# Altium project MC_V1.PrjPcb
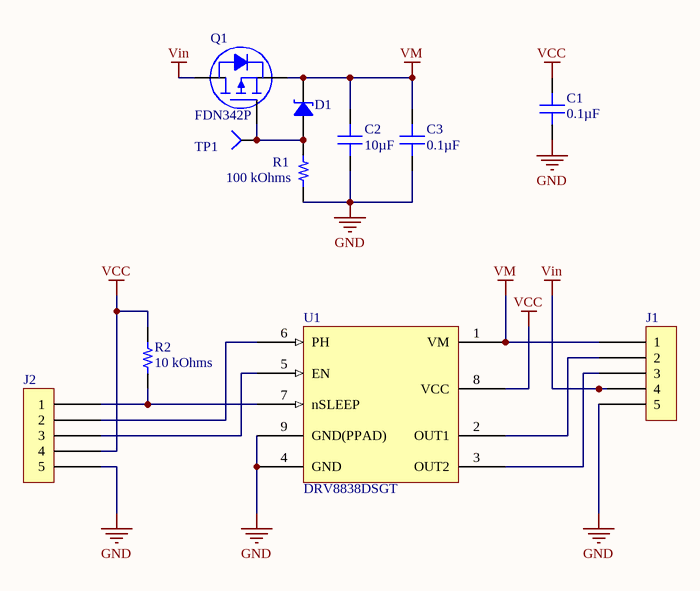
[diagram p0: schematic.SchDoc]
1 sheet, 11 parts. Net scope: global (net labels, ports and power ports of the same name join across sheets).

## Sheet schematic.SchDoc: Motor Controller
size A; DrawnBy: Kyle Hong

### Parts
C1  0.1µF  [CAP 0603_1608]
C2  10µF  [CAP 0805_2012]
C3  0.1µF  [CAP 0603_1608]
D1  1SMA5921BT3G  [DO214AC SMA]  (value not drawn)
J1  JMP_5  (value not drawn)
J2  JMP_5  (value not drawn)
Q1  FDN342P  [DIODES SOT-23-3]
R1  100 kOhms  [RES 0603_1608]
R2  10 kOhms  [RES 0603_1608]
TP1  TESTPOINT_SMD  [TESTPOINT]  (value not drawn)
U1  DRV8838DSGT

### Nets
GND: C1.1 C2.1 C3.1 J1.5 J2.5 R1.1 U1.4(GND) U1.9(GND(PPAD))
VCC: C1.2 J2.4 R2.2 U1.8(VCC)
Vin: J1.4 Q1.3(D)
VM: C2.2 C3.2 D1.2 J1.1 Q1.2(S) U1.1(VM)
NetD1_1: D1.1 Q1.1(G) R1.2 TP1.1(=value)
NetJ1_2: J1.2 U1.2(OUT1)
NetJ1_3: J1.3 U1.3(OUT2)
NetJ2_1: J2.1 R2.1 U1.7(nSLEEP)
NetJ2_2: J2.2 U1.6(PH)
NetJ2_3: J2.3 U1.5(EN)

### Notes on the sheet
- Title
- Size:
- Date:
- A
- Number:
- Time:
- Revision:
- Sheet
- of
- File:

### Library data of the parts
C1 C3 = CC0603JRX7R7BB104: CAP CER 0.1UF 16V X7R 0603; Manufacturer: Yageo; Tolerance: ±5%; Part Number: CC0603JRX7R7BB104; Value: 0.1µF; Applications: General Purpose; Capacitance: 0.1µF; ComponentLink1Description: Datasheet; ComponentLink1URL: https://www.yageo.com/upload/media/product/productsearch/datasheet/mlcc/UPY-GPHC_X7R_6.3V-to-50V_18.pdf; ComponentLink2Description: DigiKey Link; ComponentLink2URL: http://digikey.com/product-detail/en/yageo/CC0603JRX7R7BB104/311-1776-1-ND/5195678; Device Package: 0603 (1608 Metric); LastUpdated: 1/21/2020 12:02:05 AM; Lifecycle Status: Active; Minimum Order: 1; Mounting Type: Surface Mount, MLCC; Operating Temperature: -55°C ~ 125°C; Package / Case: 0603 (1608 Metric); Packaging: TapeAndReel; PartId: 5272; Part Status: Active; Price: 0.01; Series: CC; Size / Dimension: 0.063" L x 0.031" W (1.60mm x 0.80mm); Supplier 1: DigiKey; Supplier Part Number 1: 311-1776-1-ND; Temperature Coefficient: X7R; Thickness (Max): 0.035" (0.90mm); Voltage - Rated: 16V
C2 = CC0805KKX5R7BB106: CAP CER 10UF 16V X5R 0805; Manufacturer: Yageo; Tolerance: ±10%; Part Number: CC0805KKX5R7BB106; Value: 10µF; Applications: General Purpose; Capacitance: 10µF; ComponentLink1Description: Datasheet; ComponentLink1URL: https://www.yageo.com/upload/media/product/productsearch/datasheet/mlcc/UPY-GPHC_X5R_4V-to-50V_25.pdf; ComponentLink2Description: DigiKey Link; ComponentLink2URL: http://digikey.com/product-detail/en/yageo/CC0805KKX5R7BB106/311-1865-1-ND/5195767; Device Package: 0805 (2012 Metric); LastUpdated: 1/21/2020 12:02:56 AM; Lifecycle Status: Active; Minimum Order: 1; Mounting Type: Surface Mount, MLCC; Operating Temperature: -55°C ~ 85°C; Package / Case: 0805 (2012 Metric); Packaging: TapeAndReel; PartId: 8867; Part Status: Active; Price: 0.09; Series: CC; Size / Dimension: 0.079" L x 0.049" W (2.00mm x 1.25mm); Supplier 1: DigiKey; Supplier Part Number 1: 311-1865-1-ND; Temperature Coefficient: X5R; Thickness (Max): 0.057" (1.45mm); Voltage - Rated: 16V
D1 = 1SMA5921BT3G: DIODE ZENER 6.8V 1.5W SMA; Manufacturer: ON Semiconductor; Current - Reverse Leakage @ Vr: 2.5µA @ 5.2V; Impedance (Max) (Zzt): 2.5 Ohms; Tolerance: ±5%; Voltage - Forward (Vf) (Max) @ If: 1.5V @ 200mA; Part Number: 1SMA5921BT3G; ComponentLink1Description: Datasheet; ComponentLink1URL: https://www.onsemi.com/pub/Collateral/1SMA5913BT3-D.PDF; ComponentLink2Description: DigiKey Link; ComponentLink2URL: http://digikey.com/product-detail/en/on-semiconductor/1SMA5921BT3G/1SMA5921BT3GOSCT-ND/1474708; Device Package: DO-214AC, SMA; LastUpdated: 1/21/2020 2:46:09 AM; Lifecycle Status: Active; Minimum Order: 1; Mounting Type: Surface Mount; Operating Temperature: -65°C ~ 150°C; Package / Case: DO-214AC, SMA; Packaging: TapeAndReel; PartId: 1578; Part Status: Active; Power - Max: 1.5W; Price: 0.09; Series: -; Supplier 1: DigiKey; Supplier Part Number 1: 1SMA5921BT3GOSCT-ND; Supplier Device Package: SMA; Voltage - Zener (Nom) (Vz): 6.8V
J1 J2 = JMP_5: HEADER 5x1; Manufacturer 1: TE Connectivity; Manufacturer Part Number 1: 3-644456-5; Underplate Material: Nickel; Number of Positions: 5; Connector Type: Plug,Header,Pin; Gender: Male; Current Rating: 5A; Connector System: Wire-to-Board; PCB Mount Retention: Without; Voltage Rating: 250V; PCB Mounting Orientation: Vertical; Mating Alignment: No (Without); Plating Thickness: 1.27um; Contact Resistance: 6mR; Pitch: 2.54mm; PCB Thickness: 0.063inch; Tail Length: 0.11inch; Approvals: CSA; Supplier 1: Digi-Key; Stock 1: 10086; Pricing 1: 1=0.44000, 10=0.41500, 100=0.29070, 500=0.24918, 1000=0.20766, 5000=0.17799, 10000=0.16612 (USD); RoHS: Yes; Mount: Through Hole; Contact Plating: Tin,Matte; Contact Material: Copper Alloy; Housing Color: Natural; Housing Material: Polyester; Color: Natural; Contact Shape: Square; Min Operating Temperature: -67°C; Max Operating Temperature: 221°C; Termination: Solder; Orientation: Straight; Packaging: Bag; Package Quantity: 500; Number of Contacts: 5; Number of Rows: 1; Contact Current Rating: 5A; Max Voltage Rating (AC): 250V; Sealable: No (Without); Mating Retention: No (Without); PCB Mount Alignment: No (Without); Contact Gender: Male; Voltage Rating (AC): 250V; Contact Retention: No (Without); Strain Relief: No (Without); Shrouded: No (Without); Backwall/Post Interruptions: No (Without); Length: 12.4mm; Height: 10.03mm; Depth: 2.33mm; Contact Mating Length: 0.295inch; Radiation Hardening: No; REACH SVHC: Unknown; ELV: Compliant; Lead Free: Lead Free; Flammability Rating: UL94 V-0; ComponentLink1URL: https://datasheet.ciiva.com/16307/3-644456-5-16307486.pdf?src-supplier=Future+Electronics; ComponentLink1Description: https://datasheet.ciiva.com/16307/3-644456-5-16307486.pdf?src-supplier=Future+Electronics; ComponentLink2URL: https://datasheet.ciiva.com/3118/eng-ds-82056-mta-0608-3118213.pdf?src-supplier=Avnet; ComponentLink2Description: https://datasheet.ciiva.com/3118/eng-ds-82056-mta-0608-3118213.pdf?src-supplier=Avnet; ComponentLink3URL: https://datasheet.ciiva.com/14641/70087179-14641766.pdf?src-supplier=Allied+Electronics; ComponentLink3Description: https://datasheet.ciiva.com/14641/70087179-14641766.pdf?src-supplier=Allied+Electronics; ComponentLink4URL: https://datasheet.ciiva.com/30250/8852eng-ds-82056-mta-0608-30250984.pdf?src-supplier=Onlinecomponents.com; ComponentLink4Description: https://datasheet.ciiva.com/30250/8852eng-ds-82056-mta-0608-30250984.pdf?src-supplier=Onlinecomponents.com; ComponentLink5URL: https://datasheet.ciiva.com/709/eng-cd-644456-d2-709724.pdf?src-supplier=Digi-Key; ComponentLink5Description: https://datasheet.ciiva.com/709/eng-cd-644456-d2-709724.pdf?src-supplier=Digi-Key; Supplier Part Number 1: A31115-ND
Q1 = ZXMP10A13FQTA: MOSFET P-CH 20V 2A SSOT-3; Manufacturer 1: ON Semiconductor / Fairchild; Rds On Max: 80mR; Input Capacitance: 635pF; Rise Time: 8ns; Nominal Vgs: 1.05V; Number of Elements: 1; Max Power Dissipation: 500mW; Drain to Source Resistance: 62mR; Turn-Off Delay Time: 9ns; Turn-On Delay Time: 20ns; Element Configuration: Single; Drain to Source Breakdown Voltage: -20V; Gate to Source Voltage (Vgs): 12V; Current Rating: -2A; ComponentLink1Description: Datasheet; ComponentLink1URL: https://www.diodes.com/assets/Datasheets/ZXMP10A13FQ.pdf; ComponentLink2Description: DigiKey Link; ComponentLink2URL: http://digikey.com/product-detail/en/diodes-incorporated/ZXMP10A13FQTA/ZXMP10A13FQTADICT-ND/5225337; Supplier 1: Digi-Key; Manufacturer Part Number 1: FDN342P; Stock 1: 21061; Pricing 1: 1=0.49000, 10=0.42200, 25=0.39400, 100=0.29270, 250=0.27808, 500=0.22854, 1000=0.18576 (USD); RoHS: Yes; Mount: Surface Mount; Case/Package: TO-236-3; Number of Pins: 3; Weight: 0.03g; Min Operating Temperature: -55°C; Max Operating Temperature: 150°C; Packaging: Tape and Reel; Package Quantity: 1; Dual Supply Voltage: 20V; Drain to Source Voltage (Vdss): 20V; Continuous Drain Current (ID): 2A; Fall Time: 8ns; Power Dissipation: 500mW; Threshold Voltage: 1.05V; Termination: SMD/SMT; Voltage Rating (DC): -20V; On-State Resistance: 80mR; Length: 2.92mm; Height: 0.94mm; Width: 1.4mm; Radiation Hardening: No; REACH SVHC: No SVHC; Lead Free: Lead Free; ComponentLink3URL: https://datasheet.ciiva.com/16952/fdn342p-16952032.pdf?src-supplier=Future+Electronics; ComponentLink3Description: https://datasheet.ciiva.com/16952/fdn342p-16952032.pdf?src-supplier=Future+Electronics; ComponentLink4URL: https://datasheet.ciiva.com/6037/162680-6037738.pdf?src-supplier=Farnell; ComponentLink4Description: https://datasheet.ciiva.com/6037/162680-6037738.pdf?src-supplier=Farnell; ComponentLink5URL: https://datasheet.ciiva.com/4440/fdn342p-111007-4440940.pdf?src-supplier=Mouser; ComponentLink5Description: https://datasheet.ciiva.com/4440/fdn342p-111007-4440940.pdf?src-supplier=Mouser; ComponentLink6URL: https://datasheet.ciiva.com/931/fdn342p-931953.pdf?src-supplier=Digi-Key; ComponentLink6Description: https://datasheet.ciiva.com/931/fdn342p-931953.pdf?src-supplier=Digi-Key; ComponentLink7URL: https://datasheet.ciiva.com/931/fdn342p-931954.pdf?src-supplier=Digi-Key; ComponentLink7Description: https://datasheet.ciiva.com/931/fdn342p-931954.pdf?src-supplier=Digi-Key; ComponentLink8URL: https://datasheet.ciiva.com/931/fdn342p-931955.pdf?src-supplier=Digi-Key; ComponentLink8Description: https://datasheet.ciiva.com/931/fdn342p-931955.pdf?src-supplier=Digi-Key
R1 = RT0603DRE07100KL: RES SMD 100K OHM 0.5% 1/10W 0603; Manufacturer: Yageo; Power (Watts): 0.1W, 1/10W; Temperature Coefficient: ±50ppm/°C; Part Number: RT0603DRE07100KL; Value: 100 kOhms; ComponentLink1Description: Datasheet; ComponentLink1URL: https://www.yageo.com/upload/media/product/productsearch/datasheet/rchip/PYu-RT_1-to-0.01_RoHS_L_11.pdf; ComponentLink2Description: DigiKey Link; ComponentLink2URL: http://digikey.com/product-detail/en/yageo/RT0603DRE07100KL/311-2395-1-ND/6128814; Composition: Thin Film; Device Package: 0603 (1608 Metric); Height - Seated (Max): 0.022" (0.55mm); LastUpdated: 1/21/2020 12:15:09 AM; Lifecycle Status: Active; Minimum Order: 1; Number of Terminations: 2; Operating Temperature: -55°C ~ 155°C; Package / Case: 0603 (1608 Metric); Packaging: TapeAndReel; PartId: 25487; Part Status: Active; Price: 0.01; Resistance: 100 kOhms; Series: RT; Size / Dimension: 0.063" L x 0.031" W (1.60mm x 0.80mm); Supplier 1: DigiKey; Supplier Part Number 1: 311-2395-1-ND; Supplier Device Package: 0603; Tolerance: ±0.5%
R2 = AF0603FR-0710KL: RES SMD 10K OHM 1% 1/10W 0603; Manufacturer: Yageo; Power (Watts): 0.1W, 1/10W; Temperature Coefficient: ±100ppm/°C; Part Number: AF0603FR-0710KL; Value: 10 kOhms; ComponentLink1Description: Datasheet; ComponentLink1URL: http://www.yageo.com/documents/recent/PYu-AF_51_RoHS_L_6.pdf; ComponentLink2Description: DigiKey Link; ComponentLink2URL: http://digikey.com/product-detail/en/yageo/AF0603FR-0710KL/311-10KLMCT-ND/2828170; Composition: Thick Film; Device Package: 0603 (1608 Metric); Features: Anti-Sulfur, Moisture Resistant; Height - Seated (Max): 0.022" (0.55mm); LastUpdated: 1/21/2020 12:20:29 AM; Lifecycle Status: Active; Minimum Order: 1; Number of Terminations: 2; Operating Temperature: -55°C ~ 155°C; Package / Case: 0603 (1608 Metric); Packaging: TapeAndReel; PartId: 16021; Part Status: Active; Price: 0.01; Resistance: 10 kOhms; Series: AF; Size / Dimension: 0.063" L x 0.031" W (1.60mm x 0.80mm); Supplier 1: DigiKey; Supplier Part Number 1: 311-10KLMCT-ND; Supplier Device Package: 0603; Tolerance: ±1%
U1 = DRV8838DSGT: H-bridge Single Channel Motor Driver IC; Manufacturer 1: Texas Instruments; Output Current: 1.8A; Min Supply Voltage: 1.8V; Max Supply Voltage: 11V; Interface: On/Off; Number of Outputs: 1; Operating Supply Current: 100uA; Drain to Source Resistance: 280mR; Fault Protection: Over Temperature,Short Circuit; Supplier 1: Digi-Key; Stock 1: 1605; Pricing 1: 1=0.90000, 10=0.80800, 25=0.76720, 100=0.58910 (USD); RoHS: Yes; Mount: Surface Mount; Number of Pins: 8; Weight: 0.000384oz; Min Operating Temperature: -40°C; Max Operating Temperature: 85°C; Package Quantity: 250; Packaging: Tape and Reel; Max Output Current: 1.8A; Number of Drivers: 1; Length: 2.1mm; Height: 0.75mm; Width: 2.1mm; Lead Free: Lead Free; REACH SVHC: No SVHC; ComponentLink1URL: https://datasheet.ciiva.com/14266/drv8837-14266561.pdf?src-supplier=Digi-Key; ComponentLink1Description: https://datasheet.ciiva.com/14266/drv8837-14266561.pdf?src-supplier=Digi-Key; ComponentLink2URL: https://datasheet.ciiva.com/46420/1806026-46420885.pdf?src-supplier=Element14; ComponentLink2Description: https://datasheet.ciiva.com/46420/1806026-46420885.pdf?src-supplier=Element14; Manufacturer Part Number 1: DRV8838DSGT
TP1 = TESTPOINT_SMD: Part Number (MPN): *